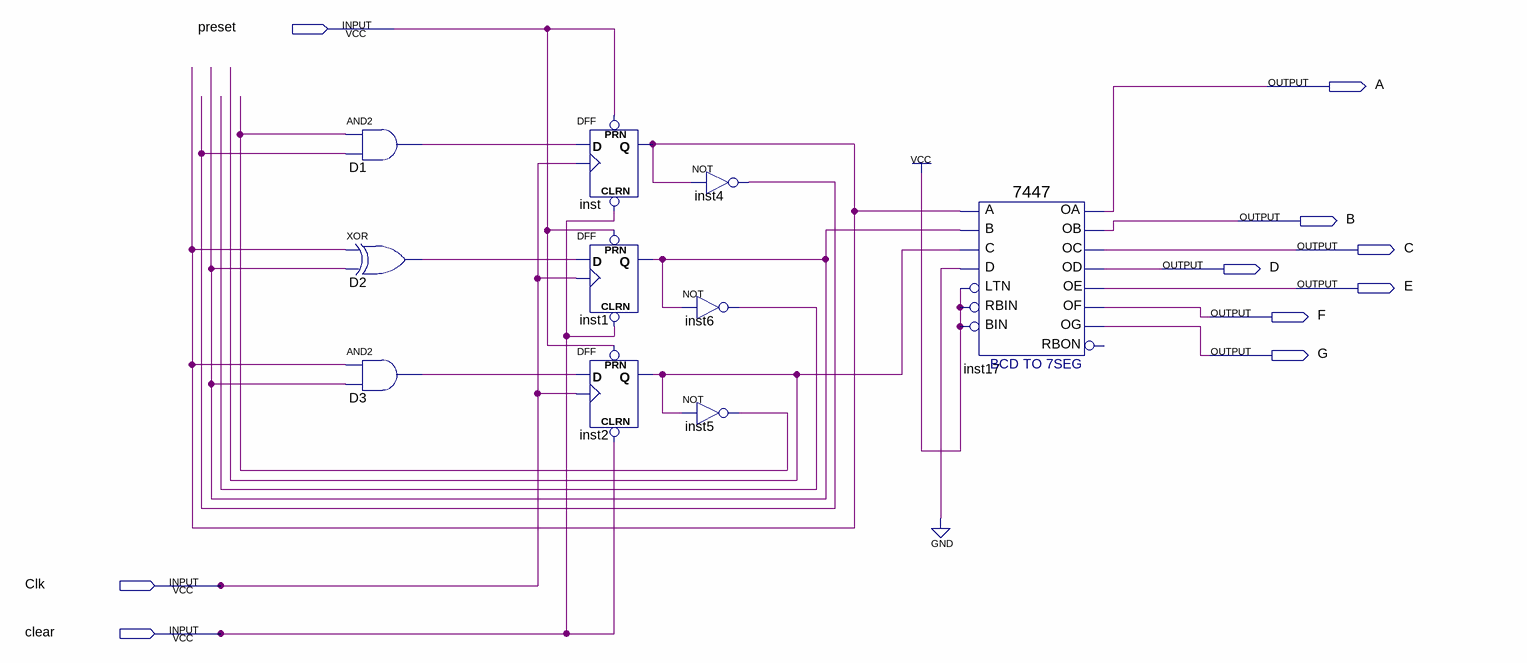
[diagram p0: schematic sheet]
// Quartus schematic CounterNam.bdf as structural Verilog: 10 symbols, 10 pins
module CounterNam (
  input  preset,
  input  Clk,
  input  clear,
  output A,
  output B,
  output C,
  output D,
  output E,
  output F,
  output G
);

  wire D1_out, D2_out, D3_out, inst1_q, inst2_q, inst4_out, inst5_out, inst6_out, inst_q;

  and D1 (D1_out, inst5_out, inst4_out);
  xor D2 (D2_out, inst_q, inst1_q);
  and D3 (D3_out, inst_q, inst1_q);
  DFF inst (.CLRN(clear), .CLK(Clk), .D(D1_out), .PRN(preset), .Q(inst_q));
  DFF inst1 (.CLRN(clear), .CLK(Clk), .D(D2_out), .PRN(preset), .Q(inst1_q));
  DFF inst2 (.CLRN(clear), .CLK(Clk), .D(D3_out), .PRN(preset), .Q(inst2_q));
  not inst4 (inst4_out, inst_q);
  not inst6 (inst6_out, inst1_q);
  not inst5 (inst5_out, inst2_q);
  \7447  inst17 (
    .LTN(1'b1), .B(inst1_q), .C(inst2_q), .D(1'b0), .RBIN(1'b1), .BIN(1'b1), .A(inst_q), .OB(B), .OC(C),
    .OE(E), .OD(D), .OF(F), .OG(G), .OA(A));  // open: RBON
endmodule
